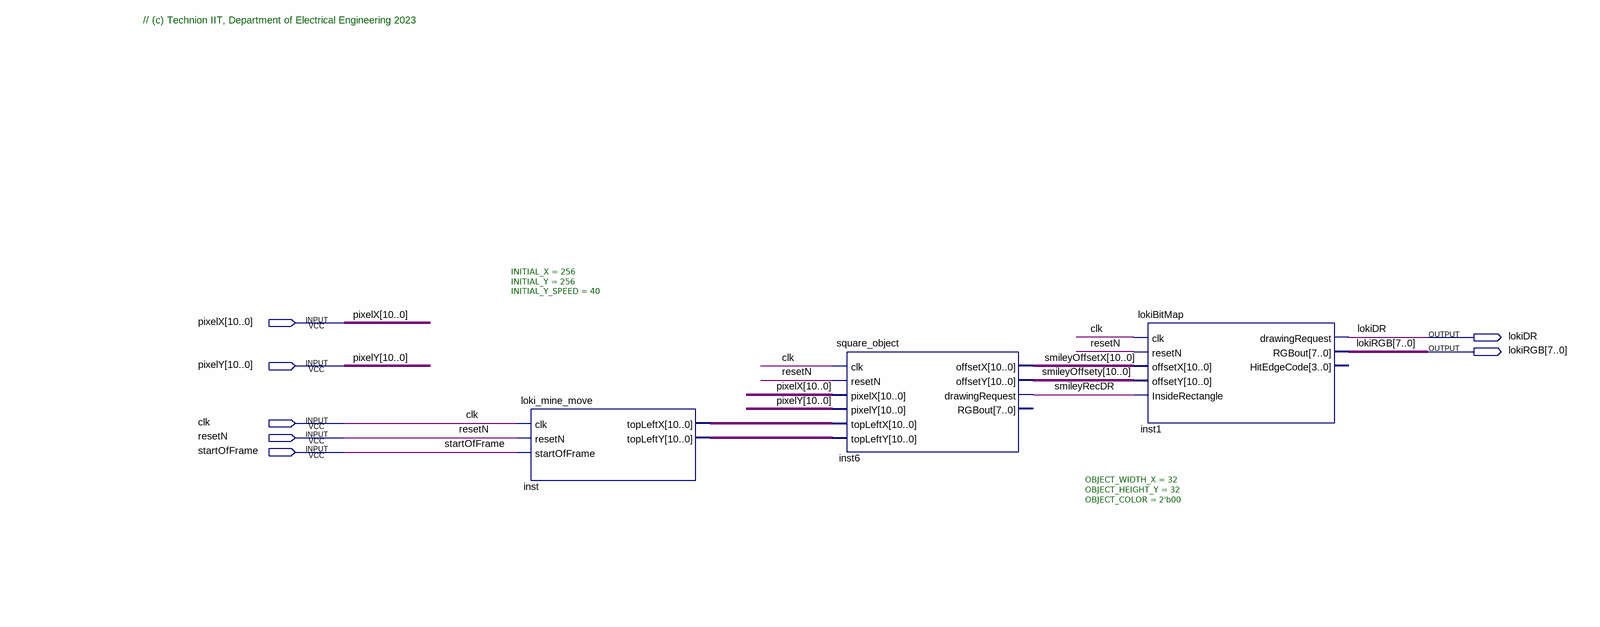
[diagram p0: schematic sheet]
// Quartus schematic loki_Block_T.bdf as structural Verilog: 3 symbols, 7 pins
module loki_Block_T (
  input  [10:0] pixelX,
  input  [10:0] pixelY,
  input  clk,
  input  resetN,
  input  startOfFrame,
  output lokiDR,
  output [7:0] lokiRGB
);

  wire smileyRecDR;
  wire [10:0] inst_topleftx, inst_toplefty, smileyOffsetX, smileyOffsety;

  loki_mine_move #(.INITIAL_X(256), .INITIAL_Y(256), .INITIAL_Y_SPEED(40)) inst (
    .clk(clk), .resetN(resetN), .startOfFrame(startOfFrame), .topLeftX(inst_topleftx),
    .topLeftY(inst_toplefty));
  square_object #(.OBJECT_WIDTH_X(32), .OBJECT_HEIGHT_Y(32), .OBJECT_COLOR(2'b00)) inst6 (
    .clk(clk), .resetN(resetN), .pixelX(pixelX), .pixelY(pixelY), .topLeftX(inst_topleftx),
    .topLeftY(inst_toplefty), .offsetX(smileyOffsetX), .offsetY(smileyOffsety), .drawingRequest(smileyRecDR));  // open: RGBout
  lokiBitMap inst1 (
    .clk(clk), .resetN(resetN), .offsetX(smileyOffsetX), .offsetY(smileyOffsety),
    .InsideRectangle(smileyRecDR), .drawingRequest(lokiDR), .RGBout(lokiRGB));  // open: HitEdgeCode

  // Notes on the sheet:
  //   // (c) Technion IIT, Department of Electrical Engineering 2023
endmodule
